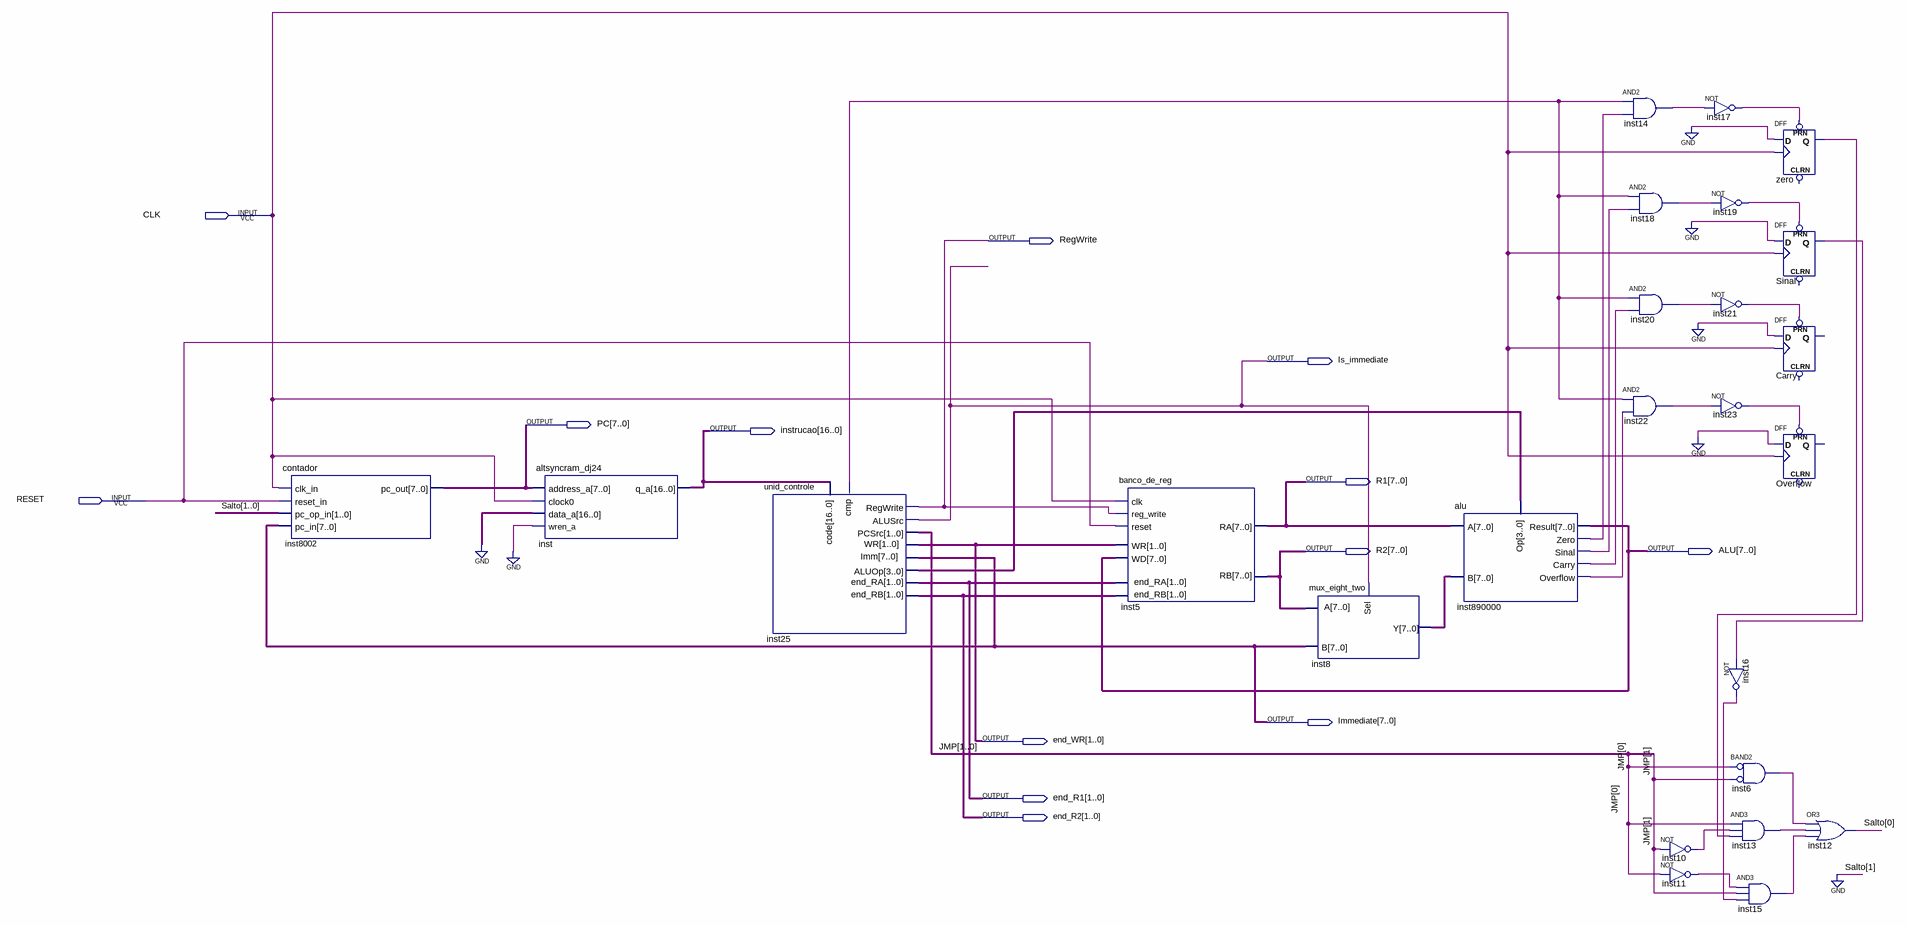
[diagram p0: schematic sheet]
// Quartus schematic cpu_offic.bdf as structural Verilog: 25 symbols, 13 pins
module cpu_offic (
  input  CLK,
  input  RESET,
  output RegWrite,
  output Is_immediate,
  output [7:0] PC,
  output [16:0] instrucao,
  output [7:0] R1,
  output [7:0] R2,
  output [7:0] ALU,
  output [7:0] Immediate,
  output [1:0] end_WR,
  output [1:0] end_R1,
  output [1:0] end_R2
);

  wire inst6_out, inst10_out, inst11_out, inst13_out, inst14_out, inst15_out, inst16_out, inst17_out,
       inst18_out, inst19_out, inst20_out, inst21_out, inst22_out, inst23_out, inst25_cmp, inst890000_carry,
       inst890000_overflow, inst890000_sinal, inst890000_zero, Sinal_q, zero_q;
  wire [0:0] Salto;
  wire [1:0] JMP;
  wire [3:0] inst25_aluop;
  wire [7:0] inst8_y;

  contador inst8002 (.clk_in(CLK), .reset_in(RESET), .pc_op_in({1'b0, Salto[0]}), .pc_in(Immediate), .pc_out(PC));
  altsyncram_dj24 inst (.address_a(PC), .clock0(CLK), .data_a({17{1'b0}}), .wren_a(1'b0), .q_a(instrucao));
  unid_controle inst25 (
    .code(instrucao), .WR(end_WR), .end_RA(end_R1), .end_RB(end_R2), .Imm(Immediate), .RegWrite(RegWrite),
    .ALUOp(inst25_aluop), .ALUSrc(Is_immediate), .PCSrc(JMP), .cmp(inst25_cmp));
  banco_de_reg inst5 (
    .clk(CLK), .reg_write(RegWrite), .reset(RESET), .WR(end_WR), .WD(ALU), .end_RA(end_R1), .end_RB(end_R2),
    .RA(R1), .RB(R2));
  mux_eight_two inst8 (.A(R2), .B(Immediate), .Sel(Is_immediate), .Y(inst8_y));
  alu inst890000 (
    .A(R1), .B(inst8_y), .Op(inst25_aluop), .Result(ALU), .Zero(inst890000_zero), .Sinal(inst890000_sinal),
    .Carry(inst890000_carry), .Overflow(inst890000_overflow));
  and inst14 (inst14_out, inst25_cmp, inst890000_zero);
  and inst18 (inst18_out, inst25_cmp, inst890000_sinal);
  and inst20 (inst20_out, inst25_cmp, inst890000_carry);
  and inst22 (inst22_out, inst25_cmp, inst890000_overflow);
  not inst10 (inst10_out, JMP[1]);
  not inst11 (inst11_out, JMP[0]);
  not inst17 (inst17_out, inst14_out);
  not inst19 (inst19_out, inst18_out);
  not inst21 (inst21_out, inst20_out);
  not inst23 (inst23_out, inst22_out);
  not inst16 (inst16_out, Sinal_q);
  and inst6 (inst6_out, ~JMP[0], ~JMP[1]);  // BAND2
  and inst13 (inst13_out, JMP[0], inst10_out, zero_q);
  and inst15 (inst15_out, inst11_out, JMP[1], inst16_out);
  DFF zero (.CLK(CLK), .D(1'b0), .PRN(inst17_out), .Q(zero_q));  // open: CLRN
  DFF Sinal (.CLK(CLK), .D(1'b0), .PRN(inst19_out), .Q(Sinal_q));  // open: CLRN
  DFF Carry (.CLK(CLK), .D(1'b0), .PRN(inst21_out));  // open: CLRN, Q
  DFF Overflow (.CLK(CLK), .D(1'b0), .PRN(inst23_out));  // open: CLRN, Q
  or inst12 (Salto[0], inst6_out, inst13_out, inst15_out);
endmodule
